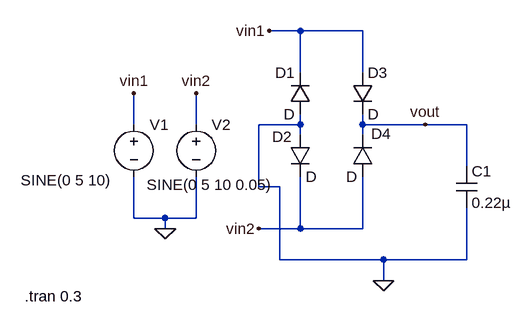
[diagram p0: schematic 1.3.2.asc]
1.3.2.asc, the LTspice schematic file:
Version 4
SHEET 1 880 680
WIRE 224 0 176 0
WIRE 320 0 224 0
WIRE 224 64 224 0
WIRE 320 64 320 0
WIRE -32 144 -32 96
WIRE 64 144 64 96
WIRE 224 144 224 128
WIRE 224 144 160 144
WIRE 320 144 320 128
WIRE 416 144 320 144
WIRE 480 144 416 144
WIRE 224 160 224 144
WIRE 320 160 320 144
WIRE 480 208 480 144
WIRE 160 240 160 144
WIRE 192 240 160 240
WIRE -32 288 -32 224
WIRE 16 288 -32 288
WIRE 64 288 64 224
WIRE 64 288 16 288
WIRE 16 304 16 288
WIRE 224 304 224 224
WIRE 224 304 160 304
WIRE 320 304 320 224
WIRE 320 304 224 304
WIRE 192 352 192 240
WIRE 352 352 192 352
WIRE 480 352 480 272
WIRE 480 352 352 352
WIRE 352 384 352 352
FLAG 16 304 0
FLAG 176 0 vin1
FLAG -32 96 vin1
FLAG 160 304 vin2
FLAG 64 96 vin2
FLAG 352 384 0
FLAG 416 144 vout
SYMBOL voltage -32 128 R0
WINDOW 3 -174 102 Left 2
WINDOW 123 0 0 Left 0
WINDOW 39 0 0 Left 0
SYMATTR Value SINE(0 5 10)
SYMATTR InstName V1
SYMBOL voltage 64 128 R0
WINDOW 3 -76 109 Left 2
WINDOW 123 0 0 Left 0
WINDOW 39 0 0 Left 0
SYMATTR Value SINE(0 5 10 0.05)
SYMATTR InstName V2
SYMBOL diode 240 128 R180
WINDOW 0 24 64 Left 2
WINDOW 3 24 0 Left 2
SYMATTR InstName D1
SYMBOL diode 208 160 R0
WINDOW 0 -27 3 Left 2
SYMATTR InstName D2
SYMBOL diode 304 64 R0
SYMATTR InstName D3
SYMBOL diode 336 224 R180
WINDOW 0 -28 66 Left 2
WINDOW 3 24 0 Left 2
SYMATTR InstName D4
SYMBOL cap 464 208 R0
SYMATTR InstName C1
SYMATTR Value 0.22µ
TEXT -200 408 Left 2 !.tran 0.3

The netlist it stands for:
* 1.3.2.asc
V1 vin1 0 SINE(0 5 10)
V2 vin2 0 SINE(0 5 10 0.05)
D1 0 vin1 D
D2 0 vin2 D
D3 vin1 vout D
D4 vin2 vout D
C1 vout 0 0.22µ
.model D D
.lib standard.dio
.tran 0.3
.backanno
.end

* Results of the author's LTspice run, read from the files saved beside the schematic
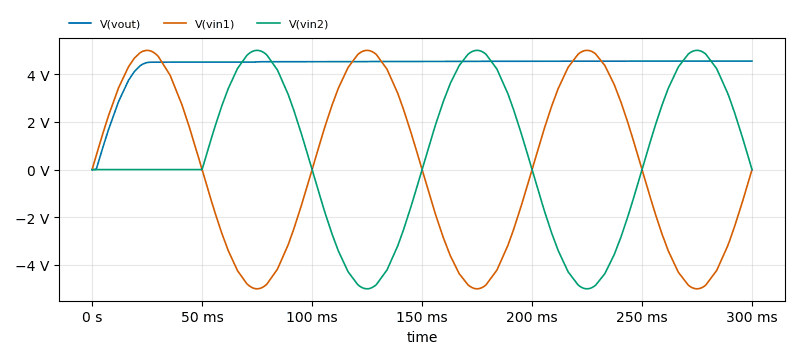
[diagram p1: Transient Analysis of 1.3.2.asc, plotted from the saved traces]
* Transient Analysis, 1 run:
*   V(vout): min 0 V, max 4.552 V, average 4.373 V, rms 4.428 V, last 4.552 V
*   V(vin1): min -5 V, max 5 V, average -214.5 µV, rms 3.531 V, last 0 V
*   V(vin2): min -5 V, max 5 V, average 528.3 mV, rms 3.222 V, last 0 V